# Altium project PCB_STATION.PrjPCB
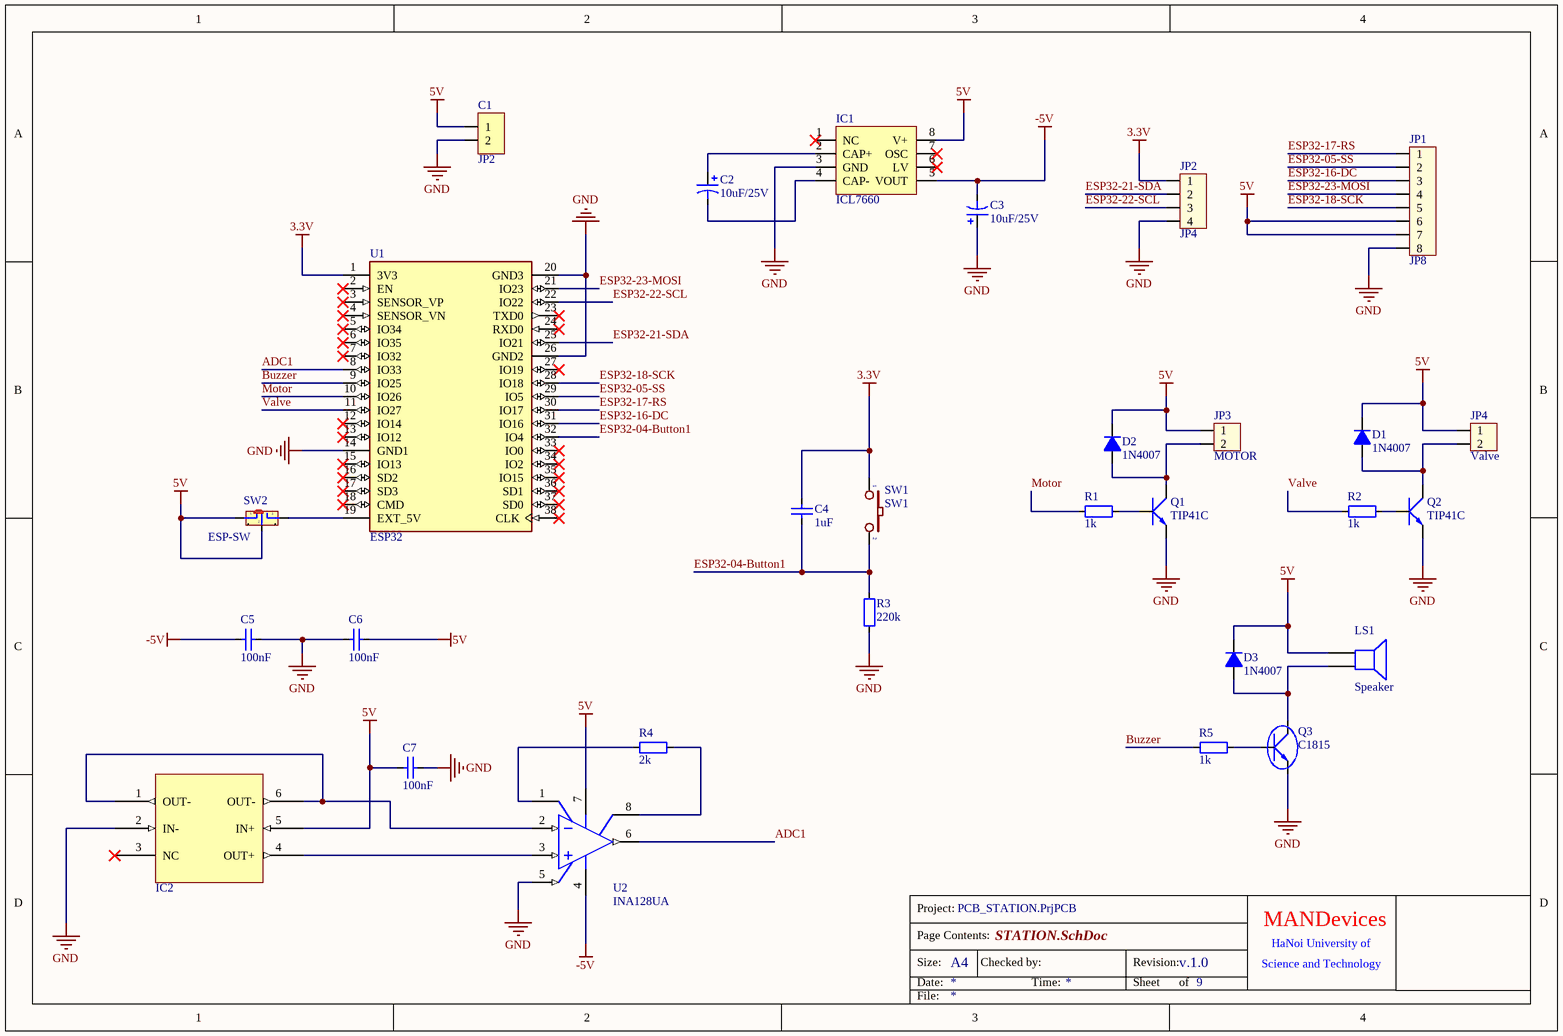
[diagram p0: STATION.SchDoc]
1 sheet, 29 parts. Net scope: global (net labels, ports and power ports of the same name join across sheets).
Board file: STATION_CT.PcbDoc

## Sheet STATION.SchDoc: =ProjectName
size A4; Author: Ven; CompanyName: IMET; Revision: v.1.0; SheetTotal: 9

### Parts
C1  JP2  [JP2-C1T]
C2  10uF/25V  [C8mm]
C3  10uF/25V  [C8mm]
C4  1uF  [CAP_0805]
C5  100nF  [CAP_0805]
C6  100nF  [CAP_0805]
C7  100nF  [CAP_0805]
D1  1N4007  [SMA]
D2  1N4007  [SMA]
D3  1N4007  [SMA]
IC1  ICL7660  [SOP-8]
IC2  MPS20N0040D-D  [SOP-6]  (value not drawn)
JP1  JP8  [CON8]
JP2  JP4  [CON4]
JP3  MOTOR  [CON2]
JP4  Valve  [CON2]
LS1  Speaker  [SPEAKER]
Q1  TIP41C  [TO-252]
Q2  TIP41C  [TO-252]
Q3  C1815  [SOT23]
R1  1k  [RES-SMD-0805]
R2  1k  [RES-SMD-0805]
R3  220k  [RES-SMD-0805]
R4  2k  [RES-SMD-0805]
R5  1k  [RES-SMD-0805]
SW1  SW1  [SW2]
SW2  ESP-SW  [SW102]
U1  ESP32  [MODULE_ESP32-DEVKITC-32D]
U2  INA128UA  [SOP-8]

### Nets
3.3V: C4.2 JP2.1 SW1.1 U1.1(3V3)
5V: C1.1 C6.2 C7.1 D1.2(K) D2.2(K) D3.2(K) IC1.8(V+) IC2.5(IN+) JP1.6 JP1.7 JP3.1 JP4.1 LS1.1 SW2.1 SW2.2 U2.7(V+)
-5V: C3.2 C5.1 IC1.5(VOUT) U2.4(V-)
GND: C1.2 C3.1 C5.2 C6.1 C7.2 IC1.3(GND) IC2.2(IN-) JP1.8 JP2.4 Q1.3(E) Q2.3(E) Q3.3(E) R3.1 U1.14(GND1) U1.20(GND3) U1.26(GND2) U2.5(REF)
ADC1: U1.8(IO33) U2.6(OUT)
Buzzer: R5.2 U1.9(IO25)
ESP32-04-Button1: C4.1 R3.2 SW1.2 U1.32(IO4)
ESP32-05-SS: JP1.2 U1.29(IO5)
ESP32-16-DC: JP1.3 U1.31(IO16)
ESP32-17-RS: JP1.1 U1.30(IO17)
ESP32-18-SCK: JP1.5 U1.28(IO18)
ESP32-21-SDA: JP2.2 U1.25(IO21)
ESP32-22-SCL: JP2.3 U1.22(IO22)
ESP32-23-MOSI: JP1.4 U1.21(IO23)
Motor: R1.2 U1.10(IO26)
Valve: R2.2 U1.11(IO27)
NetC2_1: C2.1 IC1.2(CAP+)
NetC2_2: C2.2 IC1.4(CAP-)
NetD1_1: D1.1(A) JP4.2 Q2.2(C)
NetD2_1: D2.1(A) JP3.2 Q1.2(C)
NetD3_1: D3.1(A) LS1.2 Q3.2(C)
NetIC2_1: IC2.1(OUT-) IC2.6(OUT-) U2.2(-IN)
NetIC2_4: IC2.4(OUT+) U2.3(+IN)
NetQ1_1: Q1.1(B) R1.1
NetQ2_1: Q2.1(B) R2.1
NetQ3_1: Q3.1(B) R5.1
NetR4_1: R4.1 U2.8(RG)
NetR4_2: R4.2 U2.1(RG)
NetSW2_3: SW2.3 U1.19(EXT_5V)

Not connected (* = marked no-connect by the designer): IC1 1(NC)* 6(LV)* 7(OSC)*; IC2 3(NC)*; SW2 4 5; U1 2(EN)* 3(SENSOR_VP)* 4(SENSOR_VN)* 5(IO34)* 6(IO35)* 7(IO32)* 12(IO14)* 13(IO12)* 15(IO13)* 16(SD2)* 17(SD3)* 18(CMD)* 23(TXD0)* 24(RXD0)* 27(IO19)* 33(IO0)* 34(IO2)* 35(IO15)* 36(SD1)* 37(SD0)* 38(CLK)*

### Notes on the sheet
- Project:
- MANDevices
- Page Contents:
- Size:
- Date:
- A4
- Checked by:
- Time:
- Revision:
- Sheet
- of
- HaNoi University of
- Science and Technology
- File:

### Library data of the parts
C1 = JP2: WR-PHD 2.54 mm Angled Socket Header; Manufacturer: W¨¹rth Elektronik eiSos GmbH; partNo: 613002143121; ComponentLink1 Description: Manufacturer; ComponentLink2 Description: Datasheet; NoPins: 02; Created Date: 29 March 2013; ComponentLink1URL: http://www.we-online.com; ComponentLink2URL: http://katalog.we-online.de/em/datasheet/6130xx143121.pdf; Created by: Karrer Zheng
C2 C3 = Cap Pol: Polarized Capacitor (Axial); Published: 8-Jun-2000; LatestRevisionDate: 17-Jul-2002; LatestRevisionNote: Re-released for DXP Platform.; PackageReference: POLAR0.8; Publisher: Altium Limited
C4-C7 = CapSMD: Capacitor; Value: 33p; Published: 8-Jun-2000; LatestRevisionDate: 17-Jul-2002; LatestRevisionNote: Re-released for DXP Platform.; PackageReference: RAD-0.3; Publisher: Altium Limited
D1-D3 = D1A: Diode 1A; Value: 1N4007
IC1 = ICL7660: CMOS Voltage Converters; Creator: Nguyen Ba Bien
IC2 = MPS20N0040D-D: Pressure Sensor
JP1 = Con8: Connector 8; Value: Connector 8
JP2 = Con4: Connector 4; Value: Connector 4
JP3 JP4 = Con2: Connector 2; Value: Connector 2
LS1 = Speaker: Loudspeaker; Published: 24-Mar-1999; LatestRevisionDate: 17-Jul-2002; LatestRevisionNote: Re-released for DXP Platform.; PackageReference: PIN2; Publisher: Altium Limited
Q1 Q2 = TIP41C: NPN 2W, BCE; Value: TIP41C
Q3 = 2SC5200: Transistor; Value: D718
R1-R5 = Resistor - SMD: Resistor; Manufacturer: Generic Components; Class: Passive; Published: 08/06/2000; Publisher: Altium Hobart Technology Centre
SW1 = SW2: Switch button 2 pin; Value: SW chip 2 pin
SW2 = SW102A: Switch 102 on Broad; Value: Switch 102 On Board
U1 = ESP32-DEVKITC-32D: EVAL BOARD FOR ESP-WROOM-32; MF: Espressif Systems; Value: *; MP: ESP32-DEVKITC-32D; Price: None; Check_prices: https://www.snapeda.com/parts/ESP32-DEVKITC-32D/Espressif%20Systems/view-part/2777395/?ref=eda; SnapEDA_Link: https://www.snapeda.com/parts/ESP32-DEVKITC-32D/Espressif%20Systems/view-part/2777395/?ref=snap; Availability: Warning; Purchase-URL: https://pricing.snapeda.com/search/part/ESP32-DEVKITC-32D/?ref=eda; Package: None
U2 = AD620AN: Low-Cost, Low-Power Instrumentation Amplifier; Published: 8-Jun-2000; LatestRevisionDate: 04-Mar-2005; LatestRevisionNote: Stylized 3D Model Added.; DatasheetVersion: REV.D 1998; PackageVersion: revA; PackageReference: N-8; Publisher: Altium Limited; PackageDescription: DIP; 8 Leads; Row Spacing 7.62 mm; Pitch 2.54 mm; ComponentLink1Description: Manufacturer Link; ComponentLink1URL: http://www.analog.com/en/prod/0%2C2877%2CAD620%2C00.html; ComponentLink2Description: Datasheet; ComponentLink2URL: http://www.analog.com/UploadedFiles/Data_Sheets/897653854AD620_g.pdf